# Altium schematic sheet FTDI_60X.SchDoc
size A; SheetNumber: 1; SheetTotal: 3
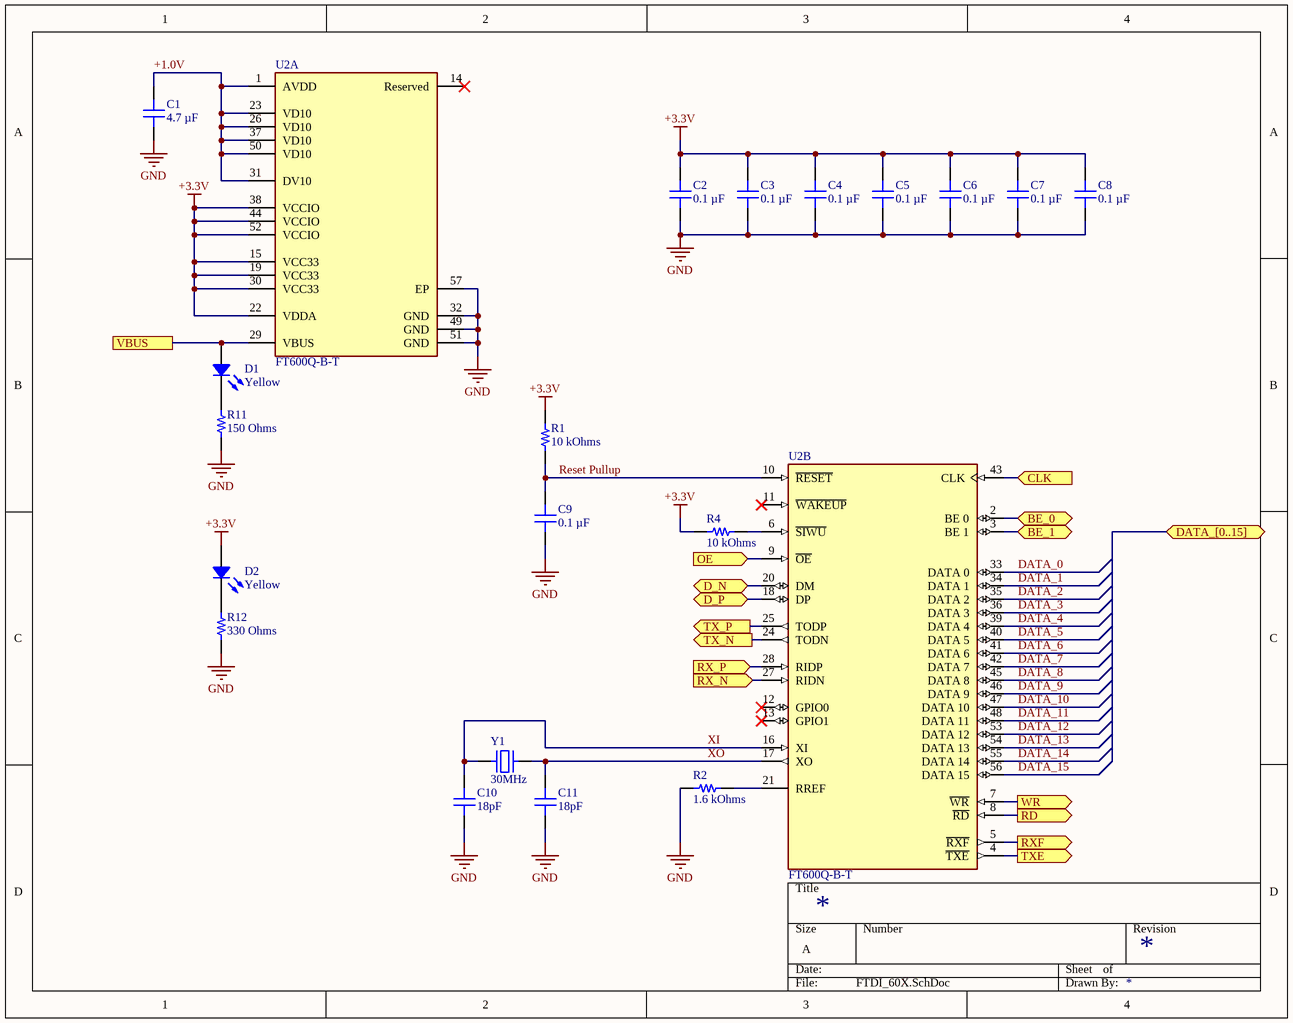
[diagram p0: FTDI_60X.SchDoc]

## Parts
C1  value 4.7 µF  [CAPC1005X06N]  (hidden comment: C0402C104K8PACTU)
C2  value 0.1 µF  [CAPC1005X06N]  (hidden comment: C0402C104K8PACTU)
C3  0.1 µF  [CAP 0603_1608]
C4  0.1 µF  [CAP 0603_1608]
C5  0.1 µF  [CAP 0603_1608]
C6  0.1 µF  [CAP 0603_1608]
C7  0.1 µF  [CAP 0603_1608]
C8  0.1 µF  [CAP 0603_1608]
C9  0.1 µF  [CAP 0603_1608]
C10  18pF  [CAP 0603_1608]
C11  18pF  [CAP 0603_1608]
D1  Yellow  [LED 1206_3216 YELLOW]
D2  Yellow  [LED 1206_3216 YELLOW]
R1  value 10 kOhms  [RESC1005X06N]  (hidden comment: CRCW040210K0FKED)
R2  value 1.6 kOhms  [RESC1005X06N]  (hidden comment: CRCW040210K0FKED)
R4  value 10 kOhms  [RESC1005X06N]  (hidden comment: CRCW040210K0FKED)
R11  150 Ohms  [RES 0603_1608]
R12  330 Ohms  [RES 0603_1608]
U2  FT600Q-B-T  [FP-QFN-56-MFG]  (parts A,B of 2)
Y1  30MHz  [ABRACON ABLS]

## Ports
BE_0 (bidir), BE_1 (bidir), CLK (in), D_N (bidir), D_P (bidir), DATA_[0..15] (bidir), OE (in), RD (out), RX_N (in), RX_P (in), RXF (out), TX_N (out), TX_P (out), TXE (out), VBUS, WR (out)

## Nets
+3.3V: C2.2 C3.2 C4.2 C5.2 C6.2 C7.2 C8.2 D2.1 R1.2 R4.2 U2.15(VCC33) U2.19(VCC33) U2.22(VDDA) U2.30(VCC33) U2.38(VCCIO) U2.44(VCCIO) U2.52(VCCIO)
GND: C1.1 C2.1 C3.1 C4.1 C5.1 C6.1 C7.1 C8.1 C9.1 C10.1 C11.1 R2.1 R11.1 R12.1 U2.32(GND) U2.49(GND) U2.51(GND) U2.57(EP)
+1.0V: C1.2 U2.1(AVDD) U2.23(VD10) U2.26(VD10) U2.31(DV10) U2.37(VD10) U2.50(VD10)
BE_0: U2.2(BE_0) ; port BE_0
BE_1: U2.3(BE_1) ; port BE_1
CLK: U2.43(CLK) ; port CLK
D_N: U2.20(DM) ; port D_N
D_P: U2.18(DP) ; port D_P
DATA_0: U2.33(DATA_0)
DATA_1: U2.34(DATA_1)
DATA_2: U2.35(DATA_2)
DATA_3: U2.36(DATA_3)
DATA_4: U2.39(DATA_4)
DATA_5: U2.40(DATA_5)
DATA_6: U2.41(DATA_6)
DATA_7: U2.42(DATA_7)
DATA_8: U2.45(DATA_8)
DATA_9: U2.46(DATA_9)
DATA_10: U2.47(DATA_10)
DATA_11: U2.48(DATA_11)
DATA_12: U2.53(DATA_12)
DATA_13: U2.54(DATA_13)
DATA_14: U2.55(DATA_14)
DATA_15: U2.56(DATA_15)
OE: U2.9(~{OE}) ; port OE
RD: U2.8(~{RD}) ; port RD
Reset Pullup: C9.2 R1.1 U2.10(~{RESET})
RX_N: U2.27(RIDN) ; port RX_N
RX_P: U2.28(RIDP) ; port RX_P
RXF: U2.5(~{RXF}) ; port RXF
TX_N: U2.24(TODN) ; port TX_N
TX_P: U2.25(TODP) ; port TX_P
TXE: U2.4(~{TXE}) ; port TXE
VBUS: D1.1 U2.29(VBUS) ; port VBUS
WR: U2.7(~{WR}) ; port WR
XI: C10.2 U2.16(XI) Y1.1
XO: C11.2 U2.17(XO) Y1.2
NetD1_2: D1.2 R11.2
NetD2_2: D2.2 R12.2
NetR2_2: R2.2 U2.21(RREF)
NetR4_1: R4.1 U2.6(~{SIWU})

Not connected (* = marked no-connect by the designer): U2 11(~{WAKEUP})* 12(GPIO0)* 13(GPIO1)* 14(Reserved)*

## Library data of the parts
C1 = CL10A475KA8NQNC: CAP CER 4.7UF 25V X5R 0603; manufacturer: Samsung Electro-Mechanics; Tolerance: ±10%; Part Number: CL10A475KA8NQNC; Applications: General Purpose; Capacitance: 4.7 µF; componentlink1description: Datasheet; componentlink1url: http://www.samsungsem.com/kr/support/product-search/mlcc/CL10A475KA8NQNC.jsp; componentlink2description: DigiKey Link; componentlink2url: https://www.digikey.com/en/products/detail/samsung-electro-mechanics/CL10A475KA8NQNC/3887558; Device Package: 0603 (1608 Metric); lastupdated: 12/20/2023 8:09:25 PM; Lifecycle Status: Active; Minimum Order: 1; Mounting Type: Surface Mount, MLCC; Operating Temperature: -55°C ~ 85°C; Package / Case: 0603 (1608 Metric); packaging: TapeAndReel; partid: 2349; Part Status: Active; price: 0.06; series: CL; Size / Dimension: 0.063" L x 0.031" W (1.60mm x 0.80mm); Supplier 1: DigiKey; Supplier Part Number 1: 1276-1900-1-ND; Temperature Coefficient: X5R; Thickness (Max): 0.035" (0.90mm); Voltage - Rated: 25V
C2-C9 = C0603C104K5RAC7411: CAP CER 0.1UF 50V X7R 0603; manufacturer: KEMET; Tolerance: ±10%; Part Number: C0603C104K5RAC7411; Applications: Bypass, Decoupling; Capacitance: 0.1 µF; componentlink1description: Datasheet; componentlink1url: https://api.kemet.com/component-edge/download/datasheet/C0603C104K5RAC7411.pdf; componentlink2description: DigiKey Link; componentlink2url: https://www.digikey.com/en/products/detail/kemet/C0603C104K5RAC7411/3317013; Device Package: 0603 (1608 Metric); lastupdated: 12/20/2023 8:09:25 PM; Lifecycle Status: Active; Minimum Order: 1; Mounting Type: Surface Mount, MLCC; Operating Temperature: -55°C ~ 125°C; Package / Case: 0603 (1608 Metric); packaging: TapeAndReel; partid: 2233; Part Status: Active; price: 0.01; series: SMD Comm X7R; Size / Dimension: 0.063" L x 0.031" W (1.60mm x 0.80mm); Supplier 1: DigiKey; Supplier Part Number 1: 399-C0603C104K5RAC7411CT-ND; Temperature Coefficient: X7R; Thickness (Max): 0.035" (0.90mm); Voltage - Rated: 50V
  C3-C9: Value: 0.1 µF
C10 C11 = SQCSVA180JAT1A: CAP CER 18PF 250V 0603; manufacturer: AVX Corporation; Temperature Coefficient: A; Tolerance: ±5%; Part Number: SQCSVA180JAT1A; Value: 18pF; Applications: RF, Microwave, High Frequency; Capacitance: 18pF; componentlink1description: Datasheet; componentlink1url: http://datasheets.avx.com/sqcs-sqcf.pdf; componentlink2description: DigiKey Link; componentlink2url: http://digikey.com/product-detail/en/avx-corporation/SQCSVA180JAT1A/478-3505-1-ND/1000464; Device Package: 0603 (1608 Metric); Features: High Q, Low Loss; lastupdated: 9/2/2020 1:03:34 AM; Lifecycle Status: Active; Minimum Order: 1; Mounting Type: Surface Mount, MLCC; Operating Temperature: -55°C ~ 125°C; Package / Case: 0603 (1608 Metric); packaging: TapeAndReel; partid: 2987; Part Status: Active; price: 0.22; series: SQ; Size / Dimension: 0.063" L x 0.032" W (1.60mm x 0.81mm); Supplier 1: DigiKey; Supplier Part Number 1: 478-3505-1-ND; Thickness (Max): 0.030" (0.76mm); Voltage - Rated: 250V
D1 D2 = CMD11-21VYC/TR8: LED YELLOW CLEAR 1206 SMD; Manufacturer: Visual Communications Company - VCC; Configuration: Standard; Current - Test: 20mA; Lens Color: 1.50mm; Lens Size: 1.10mm Dia; Lens Style: Round with Flat Top; Millicandela Rating: 6mcd; Viewing Angle: 20°; Voltage - Forward (Vf) (Typ): 2V; Wavelength - Peak: 585nm; Part Number: CMD11-21VYC/TR8; Color: Yellow; ComponentLink1Description: Datasheet; ComponentLink1URL: https://vcclite.com/wp-content/uploads/wpallimport/files/files/CMD11-21%20SMT%20LEDs%201206%20Package%20Size.pdf; ComponentLink2Description: DigiKey Link; ComponentLink2URL: https://www.digikey.com/en/products/detail/visual-communications-company-vcc/CMD11-21VYC-TR8/254830; Device Package: 1206 (3216 Metric); Height (Max): 1.50mm; LastUpdated: 12/21/2023 9:31:44 PM; Lens Transparency: Clear; Lifecycle Status: Active; Minimum Order: 1; Mounting Type: Surface Mount; Package / Case: 1206 (3216 Metric); Packaging: TapeAndReel; PartId: 6; Part Status: Active; Price: 0.22; Series: -; Size / Dimension: 3.00mm L x 1.50mm W; Supplier 1: DigiKey; Supplier Part Number 1: 28-CMD11-21VYC/TR8CT-ND; Supplier Device Package: 1206; Value: Yellow
R1 R4 = RT0603FRE0710KL: RES SMD 10K OHM 1% 1/10W 0603; Manufacturer: Yageo; Power (Watts): 0.1W, 1/10W; Temperature Coefficient: ±50ppm/°C; Part Number: RT0603FRE0710KL; ComponentLink1Description: Datasheet; ComponentLink1URL: https://www.yageo.com/upload/media/product/productsearch/datasheet/rchip/PYu-RT_1-to-0.01_RoHS_L_11.pdf; ComponentLink2Description: DigiKey Link; ComponentLink2URL: https://www.digikey.com/en/products/detail/yageo/RT0603FRE0710KL/1075040; Composition: Thin Film; Device Package: 0603 (1608 Metric); Height - Seated (Max): 0.022" (0.55mm); LastUpdated: 12/20/2023 8:39:02 PM; Lifecycle Status: Active; Minimum Order: 1; Number of Terminations: 2; Operating Temperature: -55°C ~ 155°C; Package / Case: 0603 (1608 Metric); Packaging: TapeAndReel; PartId: 5671; Part Status: Active; Price: 0.01; Resistance: 10 kOhms; Series: RT; Size / Dimension: 0.063" L x 0.031" W (1.60mm x 0.80mm); Supplier 1: DigiKey; Supplier Part Number 1: YAG2321CT-ND; Supplier Device Package: 0603; Tolerance: ±1%
R2 = CR0603-FX-1601ELF: RES SMD 1.6K OHM 1% 1/10W 0603; Manufacturer: Bourns Inc.; Power (Watts): 0.1W, 1/10W; Temperature Coefficient: ±100ppm/°C; Part Number: CR0603-FX-1601ELF; ComponentLink1Description: Datasheet; ComponentLink1URL: https://www.bourns.com/docs/Product-Datasheets/CHPREZTR.pdf; ComponentLink2Description: DigiKey Link; ComponentLink2URL: https://www.digikey.com/en/products/detail/bourns-inc/CR0603-FX-1601ELF/3783762; Composition: Thick Film; Device Package: 0603 (1608 Metric); Features: Moisture Resistant; Height - Seated (Max): 0.022" (0.55mm); LastUpdated: 12/20/2023 8:39:01 PM; Lifecycle Status: Active; Minimum Order: 1; Number of Terminations: 2; Operating Temperature: -55°C ~ 155°C; Package / Case: 0603 (1608 Metric); Packaging: CutTape; PartId: 6417; Part Status: Active; Price: 0.01; Resistance: 1.6 kOhms; Series: CR0603; Size / Dimension: 0.063" L x 0.031" W (1.60mm x 0.80mm); Supplier 1: DigiKey; Supplier Part Number 1: CR0603-FX-1601ELFCT-ND; Supplier Device Package: 0603; Tolerance: ±1%
R11 = MCT0603MD1500BP100: RES SMD 150 OHM 0.1% 1/8W 0603; Manufacturer: Vishay Beyschlag; Power (Watts): 0.125W, 1/8W; Temperature Coefficient: ±25ppm/°C; Part Number: MCT0603MD1500BP100; Value: 150 Ohms; ComponentLink1Description: Datasheet; ComponentLink1URL: http://www.vishay.com/docs/28785/mcat_pre.pdf; ComponentLink2Description: DigiKey Link; ComponentLink2URL: http://digikey.com/product-detail/en/vishay-beyschlag/MCT0603MD1500BP100/MCT0603-150-MBCT-ND/2092134; Composition: Thin Film; Device Package: 0603 (1608 Metric); Features: Anti-Sulfur, Automotive AEC-Q200; Height - Seated (Max): 0.022" (0.55mm); LastUpdated: 12/21/2023 8:41:04 PM; Lifecycle Status: Active; Minimum Order: 1; Number of Terminations: 2; Operating Temperature: -55°C ~ 155°C; Package / Case: 0603 (1608 Metric); Packaging: TapeAndReel; PartId: 5246; Part Status: Active; Price: 0.23; Ratings: AEC-Q200; Resistance: 150 Ohms; Series: MCT AT - Precision; Size / Dimension: 0.061" L x 0.033" W (1.55mm x 0.85mm); Supplier 1: DigiKey; Supplier Part Number 1: MCT0603-150-MBCT-ND; Supplier Device Package: 0603; Tolerance: ±0.1%
R12 = CMP0603AFX-3300ELF: RESHIGHPOWERA 0603 330R 1% 1/4W; Manufacturer: Bourns Inc.; Power (Watts): 0.25W, 1/4W; Temperature Coefficient: ±100ppm/°C; Part Number: CMP0603AFX-3300ELF; Value: 330 Ohms; ComponentLink1Description: Datasheet; ComponentLink1URL: https://www.bourns.com/docs/Product-Datasheets/CMP-A.pdf; ComponentLink2Description: DigiKey Link; ComponentLink2URL: https://www.digikey.com/en/products/detail/bourns-inc/CMP0603AFX-3300ELF/12333647; Composition: Thick Film; Device Package: 0603 (1608 Metric); Features: Anti-Sulfur, Automotive AEC-Q200, Moisture Resistant, Pulse Withstanding; Height - Seated (Max): 0.022" (0.55mm); LastUpdated: 12/26/2023 8:37:22 PM; Lifecycle Status: Active; Minimum Order: 1; Number of Terminations: 2; Operating Temperature: -55°C ~ 155°C; Package / Case: 0603 (1608 Metric); Packaging: TapeAndReel; PartId: 62133; Part Status: Active; Price: 0.02; Ratings: AEC-Q200; Resistance: 330 Ohms; Series: CMP-A; Size / Dimension: 0.063" L x 0.031" W (1.60mm x 0.80mm); Supplier 1: DigiKey; Supplier Part Number 1: 118-CMP0603AFX-3300ELFCT-ND; Supplier Device Package: 0603; Tolerance: ±1%
U2 = CMP-004-000002-2: USB Bus Controller, CMOS
Y1 = ABLS-30.000MHZ-B4-F-T: CRYSTAL 30.0000MHZ 18PF SMD; Manufacturer: Abracon LLC; ESR (Equivalent Series Resistance): 40 Ohms; Frequency Stability: ±50ppm; Frequency Tolerance: ±30ppm; Operating Mode: Fundamental; Part Number: ABLS-30.000MHZ-B4-F-T; ComponentLink1Description: Datasheet; ComponentLink1URL: https://abracon.com/Resonators/abls.pdf; ComponentLink2Description: DigiKey Link; ComponentLink2URL: http://digikey.com/product-detail/en/abracon-llc/ABLS-30.000MHZ-B4-F-T/535-10238-2-ND/2184181; Frequency: 30MHz; Height - Seated (Max): 0.165" (4.20mm); LastUpdated: 12/20/2023 9:30:41 PM; Lifecycle Status: Active; Load Capacitance: 18pF; Minimum Order: 0; Mounting Type: Surface Mount; Operating Temperature: -20°C ~ 70°C; Package / Case: HC-49/US; Packaging: TapeAndReel; PartId: 160; Part Status: Active; Price: 0.18; Series: ABLS; Size / Dimension: 0.449" L x 0.185" W (11.40mm x 4.70mm); Supplier 1: DigiKey; Supplier Part Number 1: 535-10238-2-ND; Type: MHz Crystal; Value: 30MHz